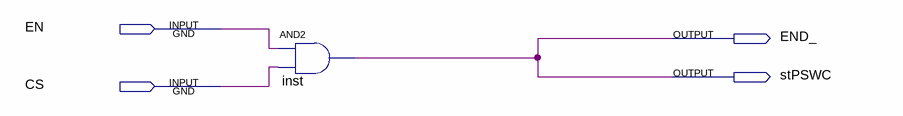
[diagram p0: schematic sheet]
// Quartus schematic SEC.bdf as structural Verilog: 1 symbols, 4 pins
module SEC (
  input  EN,
  input  CS,
  output END_,
  output stPSWC
);

  and inst (END_, EN, CS);

  assign stPSWC = END_;
endmodule
